# Altium schematic sheet UART.SchDoc
size A2
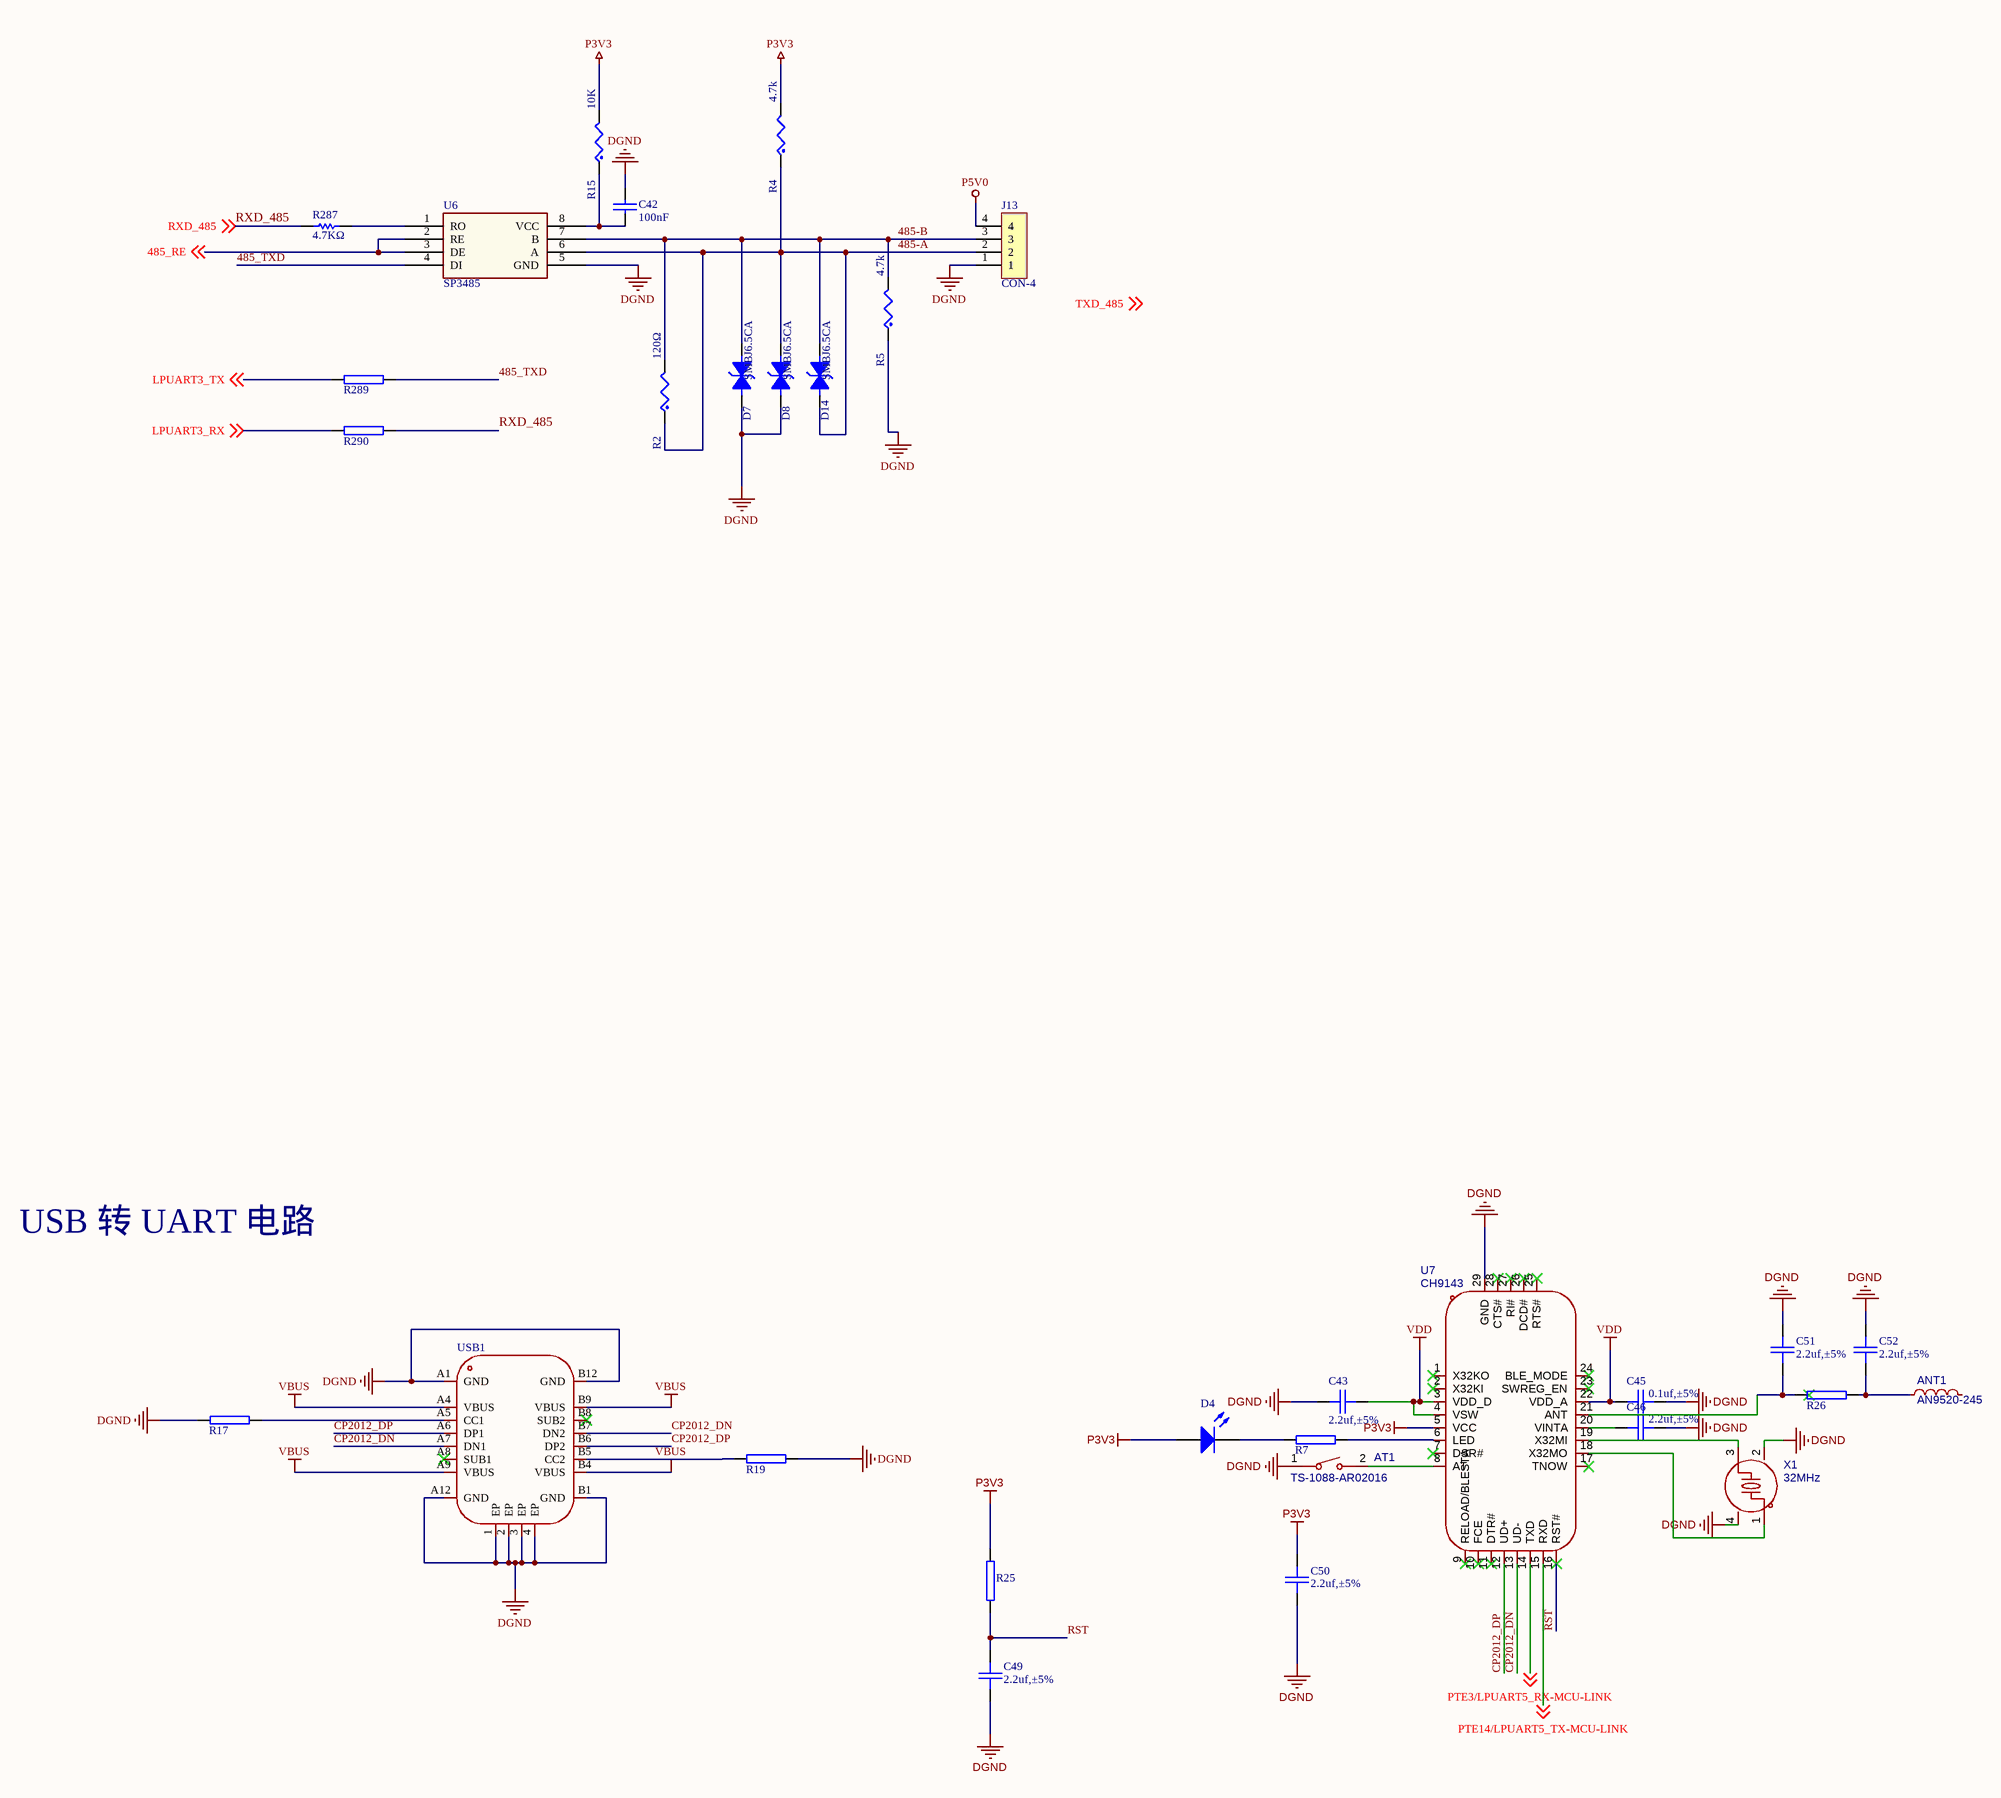
[diagram p0: UART.SchDoc]

## Parts
ANT1  AN9520-245  [ANT-SMD_L9.5-W2.1]
AT1  TS-1088-AR02016  [SW-SMD_L3.9-W3.0-P4.45]
C42  100nF  [CC0402_25]
C43  2.2uf,±5%  [CC0402_25]
C45  0.1uf,±5%  [CC0402_25]
C46  2.2uf,±5%  [CC0402_25]
C49  2.2uf,±5%  [CC0402_25]
C50  2.2uf,±5%  [CC0402_25]
C51  2.2uf,±5%  [CC0402_25]
C52  2.2uf,±5%  [CC0402_25]
D4  (no value)  [LED 0603R]
D7  SMBJ6.5CA  [1812]
D8  SMBJ6.5CA  [1812]
D14  SMBJ6.5CA  [1812]
J13  CON-4  [GSP003RC-4-3.5]
R2  120Ω  [RC0603_OV]
R4  4.7k  [RC0603_OV]
R5  4.7k  [RC0603_OV]
R7  5k1  [RC0402_25]  (value not drawn)
R15  10K  [RC0603_OV]
R17  5k1  [RC0402_25]  (value not drawn)
R19  5k1  [RC0402_25]  (value not drawn)
R25  5k1  [RC0402_25]  (value not drawn)
R26  0  [0805R]  (value not drawn)
R287  4.7KΩ  [R0402]
R289  0  [RC0402_25]  (value not drawn)
R290  0  [RC0402_25]  (value not drawn)
U6  SP3485  [SOP-8]
U7  CH9143  [QFN-28_L4.0-W4.0-P0.40-BL-EP2.7]
USB1  KH-TYPE-C-16P  [USB-C-SMD_KH-TYPE-C-16P]  (value not drawn)
X1  32MHz  [CRYSTAL-SMD_4P-L2.0-W1.6-BL]

## Nets
DGND: AT1.1 C42.2 C43.1 C45.2 C46.2 C49.1 C50.1 C51.2 C52.2 D7.1(CATHODE) D8.1(CATHODE) J13.1 R5.1 R17.2 R19.1 U6.5(GND) U7.29(GND) USB1.1(EP) USB1.2(EP) USB1.3(EP) USB1.4(EP) USB1.A1(GND) USB1.A12(GND) USB1.B1(GND) USB1.B12(GND) X1.2(GND) X1.4(GND)
P3V3: C50.2 D4.1(A) R4.2 R15.2 R25.1 U7.5(VCC)
P5V0: J13.4
VBUS: USB1.A4(VBUS) USB1.A9(VBUS) USB1.B4(VBUS) USB1.B9(VBUS)
VDD: C43.2 C45.1 U7.3(VDD_D) U7.4(VSW) U7.22(VDD_A)
485-A: D8.2(ANODE) D14.1(CATHODE) J13.2 R2.1 R4.1 U6.6(A)
485-B: D7.2(ANODE) D14.2(ANODE) J13.3 R2.2 R5.2 U6.7(B)
485_RE: U6.2(RE) U6.3(DE) ; off-sheet 485_RE
485_TXD: R289.1 U6.4(DI)
CP2012_DN: U7.13(UD-) USB1.A7(DN1) USB1.B7(DN2)
CP2012_DP: U7.12(UD+) USB1.A6(DP1) USB1.B6(DP2)
LPUART3_RX: R290.2 ; off-sheet LPUART3_RX
LPUART3_TX: R289.2 ; off-sheet LPUART3_TX
PTE3/LPUART5_RX-MCU-LINK: U7.14(TXD) ; off-sheet PTE3/LPUART5_RX-MCU-LINK
PTE14/LPUART5_TX-MCU-LINK: U7.15(RXD) ; off-sheet PTE14/LPUART5_TX-MCU-LINK
RST: C49.2 R25.2 U7.16(RST#)
RXD_485: R287.2 R290.1 ; off-sheet RXD_485
NetANT1_1: ANT1.1 C52.1 R26.1
NetAT1_2: AT1.2 U7.8(AT)
NetC42_1: C42.1 R15.1 U6.8(VCC)
NetC46_1: C46.1 U7.20(VINTA)
NetC51_1: C51.1 R26.2 U7.21(ANT)
NetD4_2: D4.2(K) R7.2
NetR7_1: R7.1 U7.6(LED)
NetR17_1: R17.1 USB1.A5(CC1)
NetR19_2: R19.2 USB1.B5(CC2)
NetR287_1: R287.1 U6.1(RO)
NetU7_18: U7.18(X32MO) X1.1
NetU7_19: U7.19(X32MI) X1.3

Not connected (* = marked no-connect by the designer): ANT1 2; U7 1(X32KO)* 2(X32KI)* 7(DSR#)* 9(RELOAD/BLESTA)* 10(FCE)* 11(DTR#)* 17(TNOW)* 23(SWREG_EN)* 24(BLE_MODE)* 25(RTS#)* 26(DCD#)* 27(RI#)* 28(CTS#)*; USB1 A8(SUB1)* B8(SUB2)*

## Notes on the sheet
- USB 转 UART 电路
- Labels drawn without touching a wire or pin: TXD_485

## Library data of the parts
ANT1 = AN9520-245: 2.4G陶瓷天线/适用于WIFI蓝牙; Manufacturer: rainsun(霖昱微); AddInBom: yes; ModelId: 396f7a811e674750a977a0c0cdc4ad7a; ModelName: ANT-SMD_L9.5-W2.1-H1.0; ModelTransform: 374.015,82.677,0,0,0,0,0.005,0,0; Symbol: AN9520-245; Device: AN9520-245; Supplier: LCSC; Manufacturer Part: AN9520-245; Supplier Part: C99665; JLCPCB Part Class: 扩展库; LCSC Part Name: AN9520-245; Supplier Footprint: SMD,2.1x9.5mm; Datasheet: https://atta.szlcsc.com/upload/public/pdf/source/20170425/1493115807294.pdf; ConvertToPcb: yes; FootprintName: ANT-SMD_L9.5-W2.1
AT1 = TS-1088-AR02016: 电路结构:单刀单掷;按钮形状:圆形按钮;作用力:160gf;安装方式:立贴;开关长度:4mm;开关宽度:3mm;开关高度:2mm;带支架:不带;触点电流:50mA;额定电压(DC):12V;绝缘电阻:100MΩ;机械寿命:10万次;; Manufacturer: XUNPU(讯普); AddInBom: yes; ModelId: b26698b69f274ffabef8a26c7d0e5dd1; ModelName: SW-SMD_L3.9-W2.9-H2.0-LS4.8; ModelTransform: 188.976,114.174,0,0,0,0,0,0,0; Circuit: 单刀单掷; Actuator Style: 圆形按钮; Operating Force: 160gf; Switch Length: 4mm; Switch Width: 3mm; Switch Height: 2mm; Strike Gundam: 不带; Contact Current: 50mA; Voltage Rating (DC): 12V; Insulation Resistance: 100MΩ; Actuator/Cap Color: 黑色; Pin Style: SMD接片; Mechanical Life: 10万次; Symbol: TS-1088-AR02016; Device: TS-1088-AR02016; Supplier: LCSC; Supplier Part: C720477; Manufacturer Part: TS-1088-AR02016; JLCPCB Part Class: 扩展库; LCSC Part Name: 4*3*2mm 立贴 轻触开关; Supplier Footprint: SMD; Datasheet: https://atta.szlcsc.com/upload/public/pdf/source/20200810/C720475_60D09DD6C54279ADDB2DC25100F1CC11.pdf; ConvertToPcb: yes; FootprintName: SW-SMD_L3.9-W3.0-P4.45; Mounting Style: 立贴; Operating Temperature: -30℃~+80℃
C42 = CAP: Capacitor
C43 C45 C46 C49-C52 = CAP1: Capacitor; 物料代码: 1.02.01.0032; 名称: 电容; 封装: 0603; 设备封装名称: C0603_104_X7R_50V_10%; 厂商: muRata; 型号: 104,±10%,50V,X7R; 贴片和直插: SMT; 器件优选方案: 量产物料,优先选用; RoHS: RoHS; ComponentLink1Description: ErpDataInfo; ComponentLink1URL: http://erp.zlgmcu.com/ErpExt/ErpData/ListMateriel.aspx?pkey=1.02.01.0032
  C43 C46 C49-C52: Value: 2.2uf,±5%
  C45: Value: 0.1uf,±5%
D4 = LED-SMT
D7 D8 D14 = BV05C
R2 R4 R5 R15 = RES: RES MF ZERO OHM 1/10W -- 0603; CLASS: DISCRETE; MFG_PN01: RC0603FR-070RL; MFG_NAME01: YAGEO AMERICA; Temp Range: –55 °C to +155 °C; CAD_APPROVED: Yes; FPLIST: RC0603_OV,RC0603,R603-X2,r603-x2_b,0603_CC,IND_0603HP_NSP,CC0603_OV_NSP; AGILE_PN: 470-80866; PCB Footprint: RC0603_OV; ROHS: Yes; HEIGHT: 0.6
R7 R17 R19 R25 R26 R289 R290 = RES2
R287 = Res1: Resistor; Value: 1K; Published: 8-Jun-2000; LatestRevisionDate: 17-Jul-2002; LatestRevisionNote: Re-released for DXP Platform.; PackageReference: AXIAL-0.3; Publisher: Altium Limited; PackageDescription: Axial Device, Thru-Hole; 2 Leads; 0.3 in Pin Spacing
U7 = CH9143: Manufacturer: WCH(南京沁恒); AddInBom: yes; ModelId: 11f4b67ac5604b8a9b305e4266e81461; ModelName: QFN-28_L4.0-W4.0-H0.9-P0.40-BL-EP; ModelTransform: 157.48,157.48,0,90,0,0,0,0,0; Symbol: CH9143; Device: CH9143; Supplier: LCSC; Supplier Part: C2887252; Manufacturer Part: CH9143; JLCPCB Part Class: 扩展库; LCSC Part Name: CH9143; Supplier Footprint: QFN-28-EP(4x4); Datasheet: https://atta.szlcsc.com/upload/public/pdf/source/20210823/518548123B20D2A3F85102F56E355BAB.pdf; ConvertToPcb: yes; FootprintName: QFN-28_L4.0-W4.0-P0.40-BL-EP2.7
USB1 = KH-TYPE-C-16P: 连接器类型:Type-C;标准:-;公母:母;端口数量:1;触点数量:16P;安装方式:卧贴;额定电流 - 电源:3A;工作温度范围:-40℃~+85℃;; Manufacturer: kinghelm(金航标); Add into BOM: yes; Connector Type: Type-C; Gender: 母; Number of Ports: 1; Number of Contacts: 16P; Current Rating - Power (Max): 3A; Symbol: KH-TYPE-C-16P; Device: KH-TYPE-C-16P; LCSC Part Name: Type-C 母 卧贴; Supplier Part: C709357; Manufacturer Part: KH-TYPE-C-16P; Supplier Footprint: SMD; Datasheet: https://atta.szlcsc.com/upload/public/pdf/source/20200911/C709357_AA8DCEB38BB20E3035A7ED7AE7667837.pdf; Supplier: LCSC; Convert to PCB: yes; Standard: -; Mounting Style: 卧贴; Operating Temperature Range: -40℃~+85℃
X1 = XL7EL89CKI-111YLC-32M: 晶振类型:贴片晶振;频率:32MHz;常温频差:±10ppm;外接负载电容:8pF;频率稳定度(全温):±20ppm;; Manufacturer: YXC(扬兴晶振); AddInBom: yes; ModelId: 51ae9b24ba7a408881f7752b57b66e45; ModelTransform: 80.709,64.961,0,0,0,0,0,0,0; Crystal Type: 贴片晶振; Normal temperature Frequency Tolerance: ±10ppm; External load capacitor: 8pF; Frequency Stability(Full temperature range): ±20ppm; Symbol: XL7EL89CKI-111YLC-32M; Device: XL7EL89CKI-111YLC-32M; Supplier: LCSC; Supplier Part: C2965582; Manufacturer Part: XL7EL89CKI-111YLC-32M; Value: 32MHz; JLCPCB Part Class: 扩展库; LCSC Part Name: 32MHz ±10ppm 8pF; Supplier Footprint: SMD2016-4P; Datasheet: https://atta.szlcsc.com/upload/public/pdf/source/20220805/1793424D7D9A48ECE748A7A37B9248AD.pdf; ConvertToPcb: yes; FootprintName: CRYSTAL-SMD_4P-L2.0-W1.6-BL; ModelName: CRYSTAL-SMD_4P-L2.0-W1.6-BL; Equivalent Series Resistance (ESR): -; Operating Temperature: -40℃~+85℃